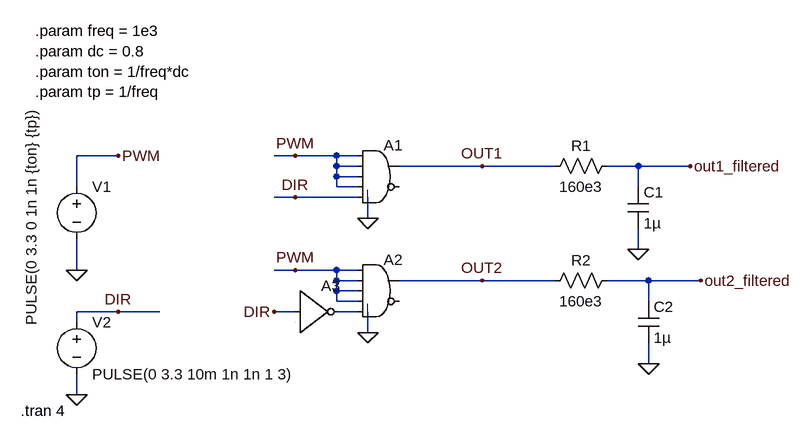
[diagram p0: schematic motor_pwm_driver.asc]
motor_pwm_driver.asc, the LTspice schematic file:
Version 4
SHEET 1 1128 680
WIRE 64 80 0 80
WIRE 336 80 304 80
WIRE 400 80 336 80
WIRE 432 80 400 80
WIRE 400 96 400 80
WIRE 432 96 400 96
WIRE 624 96 496 96
WIRE 736 96 624 96
WIRE 864 96 816 96
WIRE 944 96 864 96
WIRE 400 112 400 96
WIRE 432 112 400 112
WIRE 0 128 0 80
WIRE 400 128 400 112
WIRE 432 128 400 128
WIRE 864 128 864 96
WIRE 336 144 304 144
WIRE 432 144 336 144
WIRE 448 176 448 144
WIRE 864 224 864 192
WIRE 0 256 0 208
WIRE 336 256 304 256
WIRE 400 256 336 256
WIRE 432 256 400 256
WIRE 400 272 400 256
WIRE 432 272 400 272
WIRE 624 272 496 272
WIRE 736 272 624 272
WIRE 880 272 816 272
WIRE 960 272 880 272
WIRE 400 288 400 272
WIRE 432 288 400 288
WIRE 400 304 400 288
WIRE 432 304 400 304
WIRE 880 304 880 272
WIRE 64 320 0 320
WIRE 128 320 64 320
WIRE 336 320 304 320
WIRE 432 320 400 320
WIRE 0 336 0 320
WIRE 448 352 448 320
WIRE 880 400 880 368
WIRE 0 448 0 416
FLAG 0 256 0
FLAG 64 80 PWM
FLAG 0 448 0
FLAG 64 320 DIR
FLAG 336 80 PWM
FLAG 336 144 DIR
FLAG 336 256 PWM
FLAG 304 320 DIR
FLAG 624 96 OUT1
FLAG 624 272 OUT2
FLAG 448 176 0
FLAG 448 352 0
FLAG 864 224 0
FLAG 944 96 out1_filtered
FLAG 880 400 0
FLAG 960 272 out2_filtered
SYMBOL voltage 0 112 R0
WINDOW 3 -70 -107 VRight 2
WINDOW 123 0 0 Left 0
WINDOW 39 0 0 Left 0
SYMATTR InstName V1
SYMATTR Value PULSE(0 3.3 0 1n 1n {ton} {tp})
SYMBOL Digital\\and 464 48 R0
SYMATTR InstName A1
SYMBOL voltage 0 320 R0
WINDOW 123 0 0 Left 0
WINDOW 39 0 0 Left 0
SYMATTR InstName V2
SYMATTR Value PULSE(0 3.3 10m 1n 1n 1 3)
SYMBOL Digital\\and 464 224 R0
SYMATTR InstName A2
SYMBOL Digital\\inv 336 256 R0
SYMATTR InstName A3
SYMBOL res 832 80 R90
WINDOW 0 0 56 VBottom 2
WINDOW 3 32 56 VTop 2
SYMATTR InstName R1
SYMATTR Value 160e3
SYMBOL cap 848 128 R0
SYMATTR InstName C1
SYMATTR Value 1µ
SYMBOL res 832 256 R90
WINDOW 0 0 56 VBottom 2
WINDOW 3 32 56 VTop 2
SYMATTR InstName R2
SYMATTR Value 160e3
SYMBOL cap 864 304 R0
SYMATTR InstName C2
SYMATTR Value 1µ
TEXT -64 -112 Left 2 !.param freq = 1e3\n.param dc = 0.8\n.param ton = 1/freq*dc\n.param tp = 1/freq
TEXT -86 472 Left 2 !.tran 4

The netlist it stands for:
* motor_pwm_driver.asc
V1 PWM 0 PULSE(0 3.3 0 1n 1n {ton} {tp})
A1 PWM PWM PWM PWM DIR 0 OUT1 0 AND
V2 DIR 0 PULSE(0 3.3 10m 1n 1n 1 3)
A2 PWM PWM PWM PWM N001 0 OUT2 0 AND
A3 DIR 0 0 0 0 N001 0 0 BUF
R1 out1_filtered OUT1 160e3
C1 out1_filtered 0 1µ
R2 out2_filtered OUT2 160e3
C2 out2_filtered 0 1µ
.param freq = 1e3
.param dc = 0.8
.param ton = 1/freq*dc
.param tp = 1/freq
.tran 4
.backanno
.end